# Altium project Project-PCB.PrjPcb
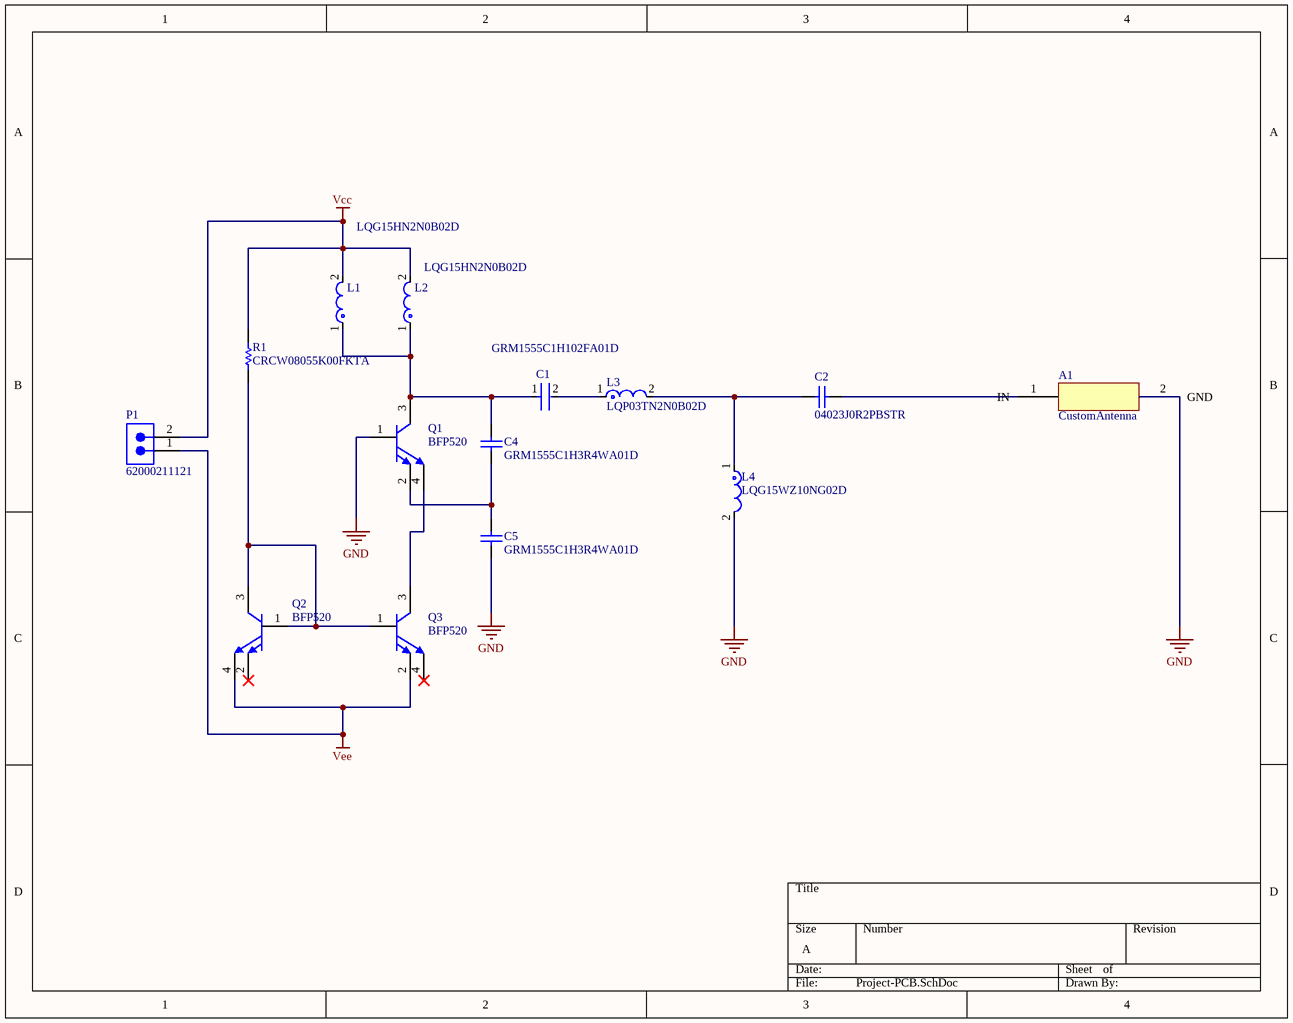
[diagram p0: Project-PCB.SchDoc]
1 sheet, 14 parts. Net scope: global (net labels, ports and power ports of the same name join across sheets).
Board file: Project-PCB.PcbDoc

## Sheet Project-PCB.SchDoc
size A; SheetNumber: 1; SheetTotal: 1

### Parts
A1  CustomAntenna  [CustomAntennaFootprint]  (net tie, no BOM)
C1  GRM1555C1H102FA01D  [FP-GRM155-0_05-IPC_B]
C2  04023J0R2PBSTR  [CAPC1006X50X20LL10T10]
C4  GRM1555C1H3R4WA01D  [CAPC1005X55X25ML05T10]
C5  GRM1555C1H3R4WA01D  [CAPC1005X55X25ML05T10]
L1  LQG15HN2N0B02D  [FP-LQG15HH_02-MFG]
L2  LQG15HN2N0B02D  [FP-LQG15HH_02-MFG]
L3  LQP03TN2N0B02D  [FP-LQP03TG_02-IPC_A]
L4  LQG15WZ10NG02D  [FP-LQG15WH_02-IPC_A]
P1  62000211121  [62000211121]
Q1  BFP520  [INF-SOT343_V]
Q2  BFP520  [INF-SOT343_V]
Q3  BFP520  [INF-SOT343_V]
R1  CRCW08055K00FKTA  [RESC2013X50X30ML20T20]

### Nets
GND: A1.2(GND) C5.1 L4.2 Q1.1(B)
Vcc: L1.2 L2.2 P1.2 R1.2
Vee: P1.1 Q2.4(E) Q3.2(E)
NetA1_1: A1.1(IN) C2.2
NetC1_1: C1.1 C4.2 L1.1 L2.1 Q1.3(C)
NetC1_2: C1.2 L3.1
NetC2_1: C2.1 L3.2 L4.1
NetC4_1: C4.1 C5.2 Q1.2(E)
NetQ1_4: Q1.4(E) Q3.3(C)
NetQ2_1: Q2.1(B) Q2.3(C) Q3.1(B) R1.1

Not connected (* = marked no-connect by the designer): Q2 2(E)*; Q3 4(E)*

### Library data of the parts
A1 = CustomAntenna: Custom Antenna from CST
C1 = CMP-06035-003843-1: Chip Multilayer Ceramic Capacitors for General Purpose, 0402, 1000pF, C0G, 30ppm/°C, 1%, 50V; Capacitance: 1nF; Width: 0.02inch; Height: 0.5mm; Material: Ceramic; Termination: SMD/SMT; Thickness: 0.022inch; Dielectric: C0G; Lead Free: Lead Free; Case/Package: 0402; Voltage Rating: 50V; Packaging: Tape and Reel; Min Operating Temperature: -55°C; Radiation Hardening: No; Tolerance: 1%; Case Code (Imperial): 0402; Package Quantity: 1; Voltage Rating (DC): 50V; Mount: Surface Mount; Length: 1mm; Case Code (Metric): 1005; Voltage: 50V; Depth: 0.5mm; Max Operating Temperature: 125°C; REACH SVHC: No SVHC
C2 = CMP-2008-04702-1: Manufacturer: AVX Interconnect / Elco; Part Number: 04023J0R2PBSTR
C4 C5 = CMP-1034-00271-2: Manufacturer: Murata; Part Number: GRM1555C1H3R4WA01D
L1 L2 = CMP-06042-001124-1: Multilayer type RF Inductor 2nH ±0.1nH 0.09Ω 900mA 0402
L3 = CMP-06042-013297-1: Film type RF Inductor 2nH ±0.1nH 600mA 0.15Ω 0201 (0603); Current: 400mA; DC Resistance (DCR): 150mR; Core Material: Non-Magnetic; Q Factor: 14; Shielding: Unshielded; Self Resonant Frequency: 12.5GHz; Test Frequency: 500MHz; Height - Seated (Max): 0.013inch; Case/Package: 0201; Depth: 0.33mm; Width: 0.012inch; Mount: Surface Mount; Case Code (Imperial): 0201; Packaging: Tape and Reel; Max DC Current: 600mA; Resistor Type: Thin Film; Case Code (Metric): 0603; Length: 0.6mm; Termination: SMD/SMT; Max Operating Temperature: 125°C; Inductance: 2nH; REACH SVHC: No SVHC; DC Current: 600mA; Package Quantity: 15000; Height: 0.3mm; Military Standard: Not; Min Operating Temperature: -55°C; Current Rating: 600mA
L4 = CMP-06042-006093-1: Multilayer type Inductor for Automotive 10nH ±2% 0.19Ω 500mA 0402
P1 = CMP-1502-00956-4: NexarPartId: 61924778; Current Rating: 2A; Operating Supply Voltage: 200V; Contact Resistance: 20mΩ; Number of Contacts: 2; Gender: Male; RoHS: Non-Compliant; Max Operating Temperature: 105°C; Voltage Rating: 200V; Contact Material: Gold; Height: 6.35mm; Number of Rows: 1; Lead Pitch: 2mm; Min Operating Temperature: -40°C; Number of Pins: 2; Orientation: Vertical
Q1-Q3 = CMP-1202-00001-1: NPN Silicon RF Transistor, 2.5 V VCEO, 40 mA IC, 23.5 dB Gmax, SOT343, Green; Manufacturer: Infineon; Green: yes; Gmax (typ): 23.5 dB; VCEO (max): 2.5 V; IC (max): 40 mA; NFmin (typ): 0.95 dB; Ptot (max): 100 mW; PackageDescription: 4-Pin Small Outline Transistor Package, 1.25 x 2 mm Body; ComponentLink2URL: http://www.infineon.com/dgdl/bfp520.pdf?folderId=db3a30431400ef68011425b291f205c5&fileId=db3a30431400ef680114275a86cd0745&location=en.Products.RF.RF_Transistors_.Low_Noise_Si_Transistors_up_to_5_GHz_.DATASHEET.bfp520.pdf; ComponentLink3URL: http://www.infineon.com/dgdl/SOT343-Package_Overview.pdf?folderId=db3a30431936bc4b0119535155343cba&fileId=db3a30431936bc4b0119535a9f393cd3; PackageReference: SOT343; ComponentLink1URL: http://www.infineon.com/; ComponentLink3Description: Package Specification; Mounting Technology: Surface Mount; DatasheetVersion: Aug-2010; ComponentLink1Description: Manufacturer URL; ComponentLink2Description: Datasheet; Halogen-free: yes; PartNumber: BFP520
R1 = CMP-2001-04239-1: Manufacturer: Vishay Dale; Part Number: CRCW08055K00FKTA